# Altium schematic sheet mcu_Model.SchDoc: MCU模块
size A4; Author: 潘全星; DocumentNumber: 02
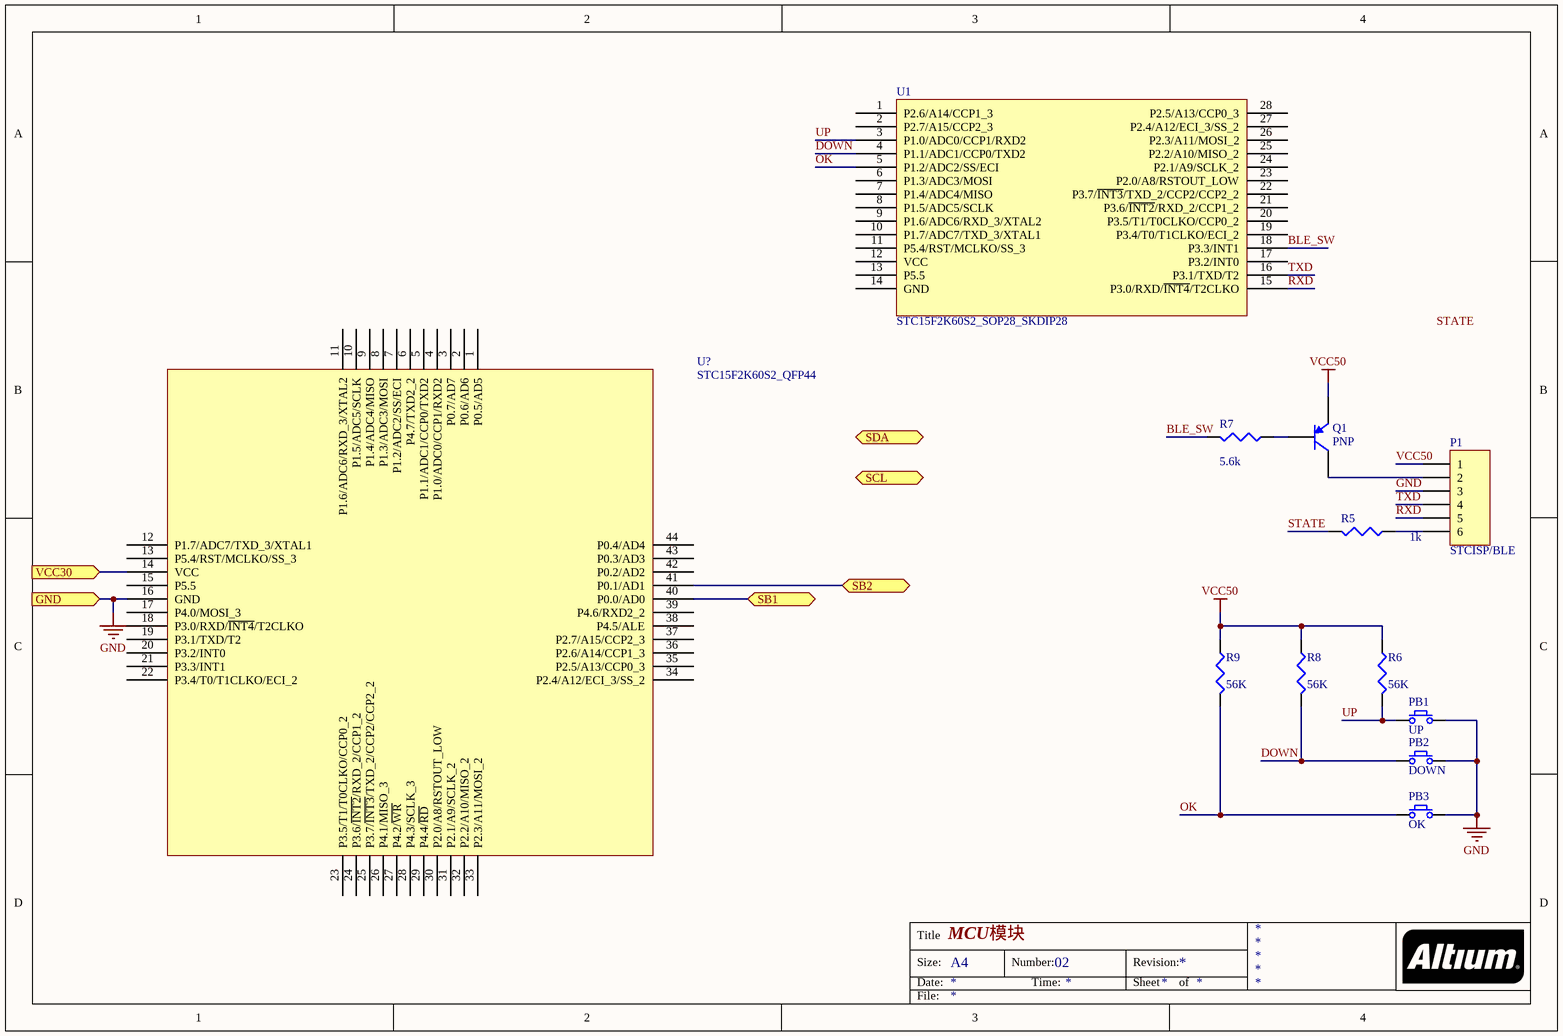
[diagram p0: mcu_Model.SchDoc]

## Parts
P1  STCISP/BLE  [HDR1X6]
PB1  UP  [Botton]
PB2  DOWN  [Botton]
PB3  OK  [Botton]
Q1  PNP  [SOT-23B_N]
R5  value 1k  [RES-1206]
R6  value 56K  [RES-1206]
R7  value 5.6k  [RES-1206]
R8  value 56K  [RES-1206]
R9  value 56K  [RES-1206]
U1  STC15F2K60S2_SOP28_SKDIP28  [SOP28]
U?  STC15F2K60S2_QFP44  [PQFP44]

## Ports
GND (in), SB1 (bidir), SB2 (bidir), SCL (bidir), SDA (bidir), VCC30 (in)

## Nets
GND: P1.3 PB1.2 PB2.2 PB3.2 U?.16(GND) ; port GND
VCC50: P1.1 Q1.3(E) R6.1 R8.1 R9.1
BLE_SW: R7.2 U1.18(P3.3/INT1)
DOWN: PB2.1 R8.2 U1.4(P1.1/ADC1/CCP0/TXD2)
OK: PB3.1 R9.2 U1.5(P1.2/ADC2/SS/ECI)
RXD: P1.5 U1.15(P3.0/RXD/~{INT4}/T2CLKO)
SB1: U?.40(P0.0/AD0) ; port SB1
SB2: U?.41(P0.1/AD1) ; port SB2
STATE: R5.2
TXD: P1.4 U1.16(P3.1/TXD/T2)
UP: PB1.1 R6.2 U1.3(P1.0/ADC0/CCP1/RXD2)
VCC30: U?.14(VCC) ; port VCC30
NetP1_2: P1.2 Q1.1(C)
NetP1_6: P1.6 R5.1
NetQ1_2: Q1.2(B) R7.1

Not connected (* = marked no-connect by the designer): U1 1(P2.6/A14/CCP1_3) 2(P2.7/A15/CCP2_3) 6(P1.3/ADC3/MOSI) 7(P1.4/ADC4/MISO) 8(P1.5/ADC5/SCLK) 9(P1.6/ADC6/RXD_3/XTAL2) 10(P1.7/ADC7/TXD_3/XTAL1) 11(P5.4/RST/MCLKO/SS_3) 12(VCC) 13(P5.5) 14(GND) 17(P3.2/INT0) 19(P3.4/T0/T1CLKO/ECI_2) 20(P3.5/T1/T0CLKO/CCP0_2) 21(P3.6/~{INT2}/RXD_2/CCP1_2) 22(P3.7/~{INT3}/TXD_2/CCP2/CCP2_2) 23(P2.0/A8/RSTOUT_LOW) 24(P2.1/A9/SCLK_2) 25(P2.2/A10/MISO_2) 26(P2.3/A11/MOSI_2) 27(P2.4/A12/ECI_3/SS_2) 28(P2.5/A13/CCP0_3); U? 1(P0.5/AD5) 2(P0.6/AD6) 3(P0.7/AD7) 4(P1.0/ADC0/CCP1/RXD2) 5(P1.1/ADC1/CCP0/TXD2) 6(P4.7/TXD2_2) 7(P1.2/ADC2/SS/ECI) 8(P1.3/ADC3/MOSI) 9(P1.4/ADC4/MISO) 10(P1.5/ADC5/SCLK) 11(P1.6/ADC6/RXD_3/XTAL2) 12(P1.7/ADC7/TXD_3/XTAL1) 13(P5.4/RST/MCLKO/SS_3) 15(P5.5) 17(P4.0/MOSI_3) 18(P3.0/RXD/~{INT4}/T2CLKO) 19(P3.1/TXD/T2) 20(P3.2/INT0) 21(P3.3/INT1) 22(P3.4/T0/T1CLKO/ECI_2) 23(P3.5/T1/T0CLKO/CCP0_2) 24(P3.6/~{INT2}/RXD_2/CCP1_2) 25(P3.7/~{INT3}/TXD_2/CCP2/CCP2_2) 26(P4.1/MISO_3) 27(P4.2/~{WR}) 28(P4.3/SCLK_3) 29(P4.4/~{RD}) 30(P2.0/A8/RSTOUT_LOW) 31(P2.1/A9/SCLK_2) 32(P2.2/A10/MISO_2) 33(P2.3/A11/MOSI_2) 34(P2.4/A12/ECI_3/SS_2) 35(P2.5/A13/CCP0_3) 36(P2.6/A14/CCP1_3) 37(P2.7/A15/CCP2_3) 38(P4.5/ALE) 39(P4.6/RXD2_2) 42(P0.2/AD2) 43(P0.3/AD3) 44(P0.4/AD4)

## Notes on the sheet
- Labels drawn without touching a wire or pin: STATE
- Title
- Size:
- Date:
- A4
- Number:
- Time:
- Revision:
- Sheet
- of
- File:

## Library data of the parts
P1 = Header 6: Header, 6-Pin; LatestRevisionDate: 17-Jul-2002; LatestRevisionNote: Re-released for DXP Platform.; Publisher: Altium Limited
PB1-PB3 = PB
Q1 = PNP: PNP Bipolar Transistor; Published: 8-Jun-2000; LatestRevisionDate: 29-May-2009; LatestRevisionNote: IPC-7351 Footprint Added.; PackageVersion: Aug-1999; PackageReference: SOT-23B; Publisher: Altium Limited; PackageDescription: 3-Pin SOT-23 Package 0.95 mm Pitch, 2.4 mm Lead Span
R5-R9 = Res3: Resistor; Published: 8-Jun-2000; LatestRevisionDate: 29-May-2009; LatestRevisionNote: IPC-7351 Footprint Added.; PackageReference: J1-0603; Publisher: Altium Limited; PackageDescription: Chip Resistor